# EAGLE design rosscomp_smd (EAGLE 9.0.0)
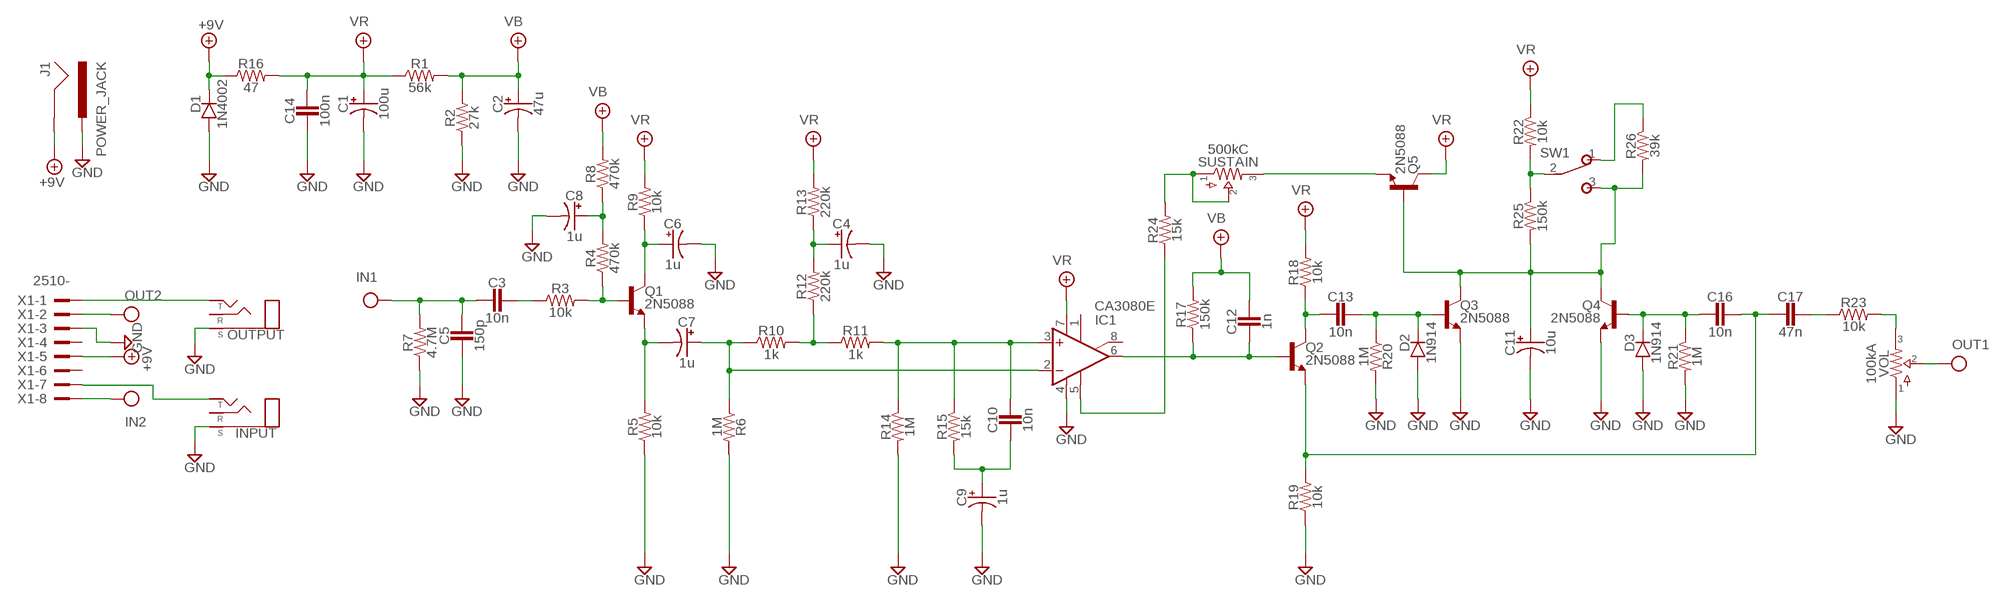
[diagram p0: schematic, sheet 1]

## Parts
C1  100u  CAP-POL0605  [CPOL-0605]
C2  47u  CAP-POL0505  [CPOL-0505]
C3  10n  CAP0805  [0805]
C4  1u  CAP-POL0405  [CPOL-0405]
C5  150p  CAP0805  [0805]
C6  1u  CAP-POL0405  [CPOL-0405]
C7  1u  CAP-POL0405  [CPOL-0405]
C8  1u  CAP-POL0405  [CPOL-0405]
C9  1u  CAP-POL0405  [CPOL-0405]
C10  10n  CAP0805  [0805]
C11  10u  CAP-POL0405  [CPOL-0405]
C12  1n  CAP0805  [0805]
C13  10n  CAP0805  [0805]
C14  100n  CAP0805  [0805]
C16  10n  CAP0805  [0805]
C17  47n  CAP0805  [0805]
D1  1N4002  DIODEDO214AC  [D-DO214AC]
D2  1N914  DIODESOD323  [D-SOD323]
D3  1N914  DIODESOD323  [D-SOD323]
IC1  CA3080E  3080SMD  [SO08]
INPUT  STEREONMJ  [NMJ6HCD2]
J1  POWER_JACK  [POWER_JACK_PTH]
OUTPUT  STEREONMJ  [NMJ6HCD2]
Q1  2N5088  NPNNPN  [SOT23]
Q2  2N5088  NPNNPN  [SOT23]
Q3  2N5088  NPNNPN  [SOT23]
Q4  2N5088  NPNNPN  [SOT23]
Q5  2N5088  NPNNPN  [SOT23]
R1  56k  RESISTOR0805  [0805]
R2  27k  RESISTOR0805  [0805]
R3  10k  RESISTOR0805  [0805]
R4  470k  RESISTOR0805  [0805]
R5  10k  RESISTOR0805  [0805]
R6  1M  RESISTOR0805  [0805]
R7  4.7M  RESISTOR0805  [0805]
R8  470k  RESISTOR0805  [0805]
R9  10k  RESISTOR0805  [0805]
R10  1k  RESISTOR0805  [0805]
R11  1k  RESISTOR0805  [0805]
R12  220k  RESISTOR0805  [0805]
R13  220k  RESISTOR0805  [0805]
R14  1M  RESISTOR0805  [0805]
R15  15k  RESISTOR0805  [0805]
R16  47  RESISTOR1206  [1206]
R17  150k  RESISTOR0805  [0805]
R18  10k  RESISTOR0805  [0805]
R19  10k  RESISTOR0805  [0805]
R20  1M  RESISTOR0805  [0805]
R21  1M  RESISTOR0805  [0805]
R22  10k  RESISTOR0805  [0805]
R23  10k  RESISTOR0805  [0805]
R24  15k  RESISTOR0805  [0805]
R25  150k  RESISTOR0805  [0805]
R26  39k  RESISTOR0805  [0805]
SUSTAIN  500kC  POTS16MM  [16MM]
SW1  SPDT  [M9040P]
VOL  100kA  POTS16MM  [16MM]
X1  2510-  [PAK100/2500-10]

## Nets
+9V: D1.C J1.GND R16.1 X1.5
GND: C1.- C2.- C4.- C5.2 C6.- C8.- C9.- C11.- C14.1 D1.A D2.2(A) D3.2(A) IC1.4(V-) INPUT.S J1.PWR OUTPUT.S Q3.E Q4.E R2.1 R5.1 R6.2 R7.1 R14.2 R19.1 R20.2 R21.2 VOL.1 X1.3
IN: C3.2 C5.1 R7.2 X1.8
N$1: INPUT.T X1.7
N$2: C3.1 R3.1
N$3: Q1.B R3.2 R4.1
N$4: OUTPUT.T X1.1
N$5: C8.+ R4.2 R8.1
N$6: R26.1 SW1.1(O)
N$7: C6.+ Q1.C R9.1
N$8: C7.+ IC1.2(-IN) R6.1 R10.1
N$9: C7.- Q1.E R5.2
N$10: C10.1 IC1.3(+IN) R11.2 R14.1 R15.1
N$11: R10.2 R11.1 R12.1
N$12: C4.+ R12.2 R13.1
N$13: C9.+ C10.2 R15.2
N$14: C13.2 Q2.C R18.1
N$15: C12.2 IC1.6(OUT) Q2.B R17.1
N$16: C16.1 C17.2 Q2.E R19.2
N$17: C13.1 D2.1(C) Q3.B R20.1
N$18: C11.+ Q3.C Q4.C Q5.B R25.2 R26.2 SW1.3(S)
N$19: C16.2 D3.1(C) Q4.B R21.1
N$20: R22.2 R25.1 SW1.2(P)
N$21: C17.1 R23.1
N$22: R23.2 VOL.3
N$23: Q5.E SUSTAIN.3
N$25: R24.2 SUSTAIN.1 SUSTAIN.2
N$26: IC1.5(OPT) R24.1
OUT: VOL.2 X1.2
VB: C2.+ C12.1 R1.2 R2.2 R8.2 R17.2
VR: C1.+ C14.2 IC1.7(V+) Q5.C R1.1 R9.2 R13.2 R16.2 R18.2 R22.1
Unconnected: IC1.1(ON1) IC1.8(ON2) INPUT.R OUTPUT.R X1.4 X1.6

## Library data of the parts
C1 C2 C4 C6-C9 C11 = pedals-SMD:CAP-POL
C3 C5 C10 C12-C14 C16 C17 = pedals-SMD:CAP
D1-D3 = pedals-SMD:DIODE
IC1 = pedals-integrated circuits:3080: OP AMP
INPUT OUTPUT = pedals-jacks:STEREO
J1 = pedals-jacks:POWER_JACK: Power Jack Connector This is the standard 5.5mm barrel jack for power. The PTH is the most common, proven, reliable, footprint. The Slot footprint only works if the mill layer is transmitted to the PCB fab house so be warned. Here are the connectors we sell at SparkFun: DC Barrel Power Jack/Connector <https://www.sparkfun.com/products/119> (PRT-00119) DC Barrel Power Jack/Connector (SMD) <https://www.sparkfun.com/products/12748> (PRT-12748) DC Barrel Jack Adapter - Breadboard Compatible <https://www.sparkfun.com/products/10811> (PRT-10811) It is used on this SparkFun product (and many, many others): SparkFun RedBoard - Programmed with Arduino <https://www.sparkfun.com/products/12757> (DEV-12757) Also, if you need a mating power supply or connector, please check these out: Wall Adapter Power Supply - 9VDC 650mA <https://www.sparkfun.com/products/298> (TOL-00298) DC Barrel Jack Adapter - Male <https://www.sparkfun.com/products/10287> (PRT-10287); PROD_ID: CONN-08197
Q1-Q5 = pedals-SMD:NPN
R1-R26 = pedals-SMD:RESISTOR
SUSTAIN VOL = pedals-potentiometers:POTS
SW1 = pedals-switches:SPDT: TOGGLE SWITCH Marquardt
X1 = pedals-headers:2510-: 3M (TM) Pak 100 4-Wall Header Source: 3M; MF: 3M; MPN: 2510-6002UB; OC_FARNELL: 9838244; OC_NEWARK: 46F4725

## Board
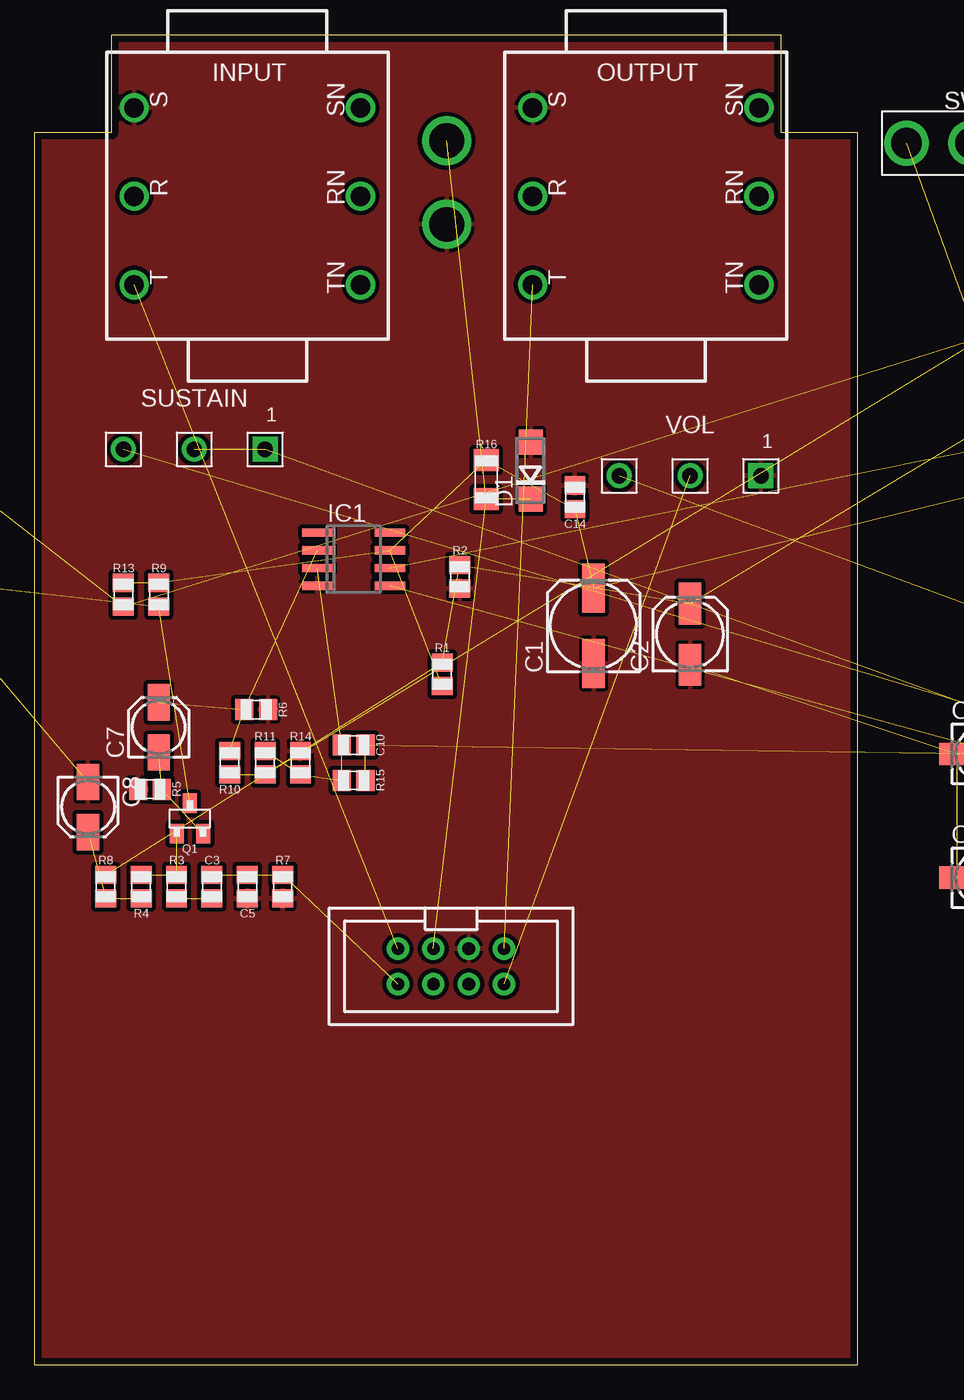
[diagram p1: board, top side]
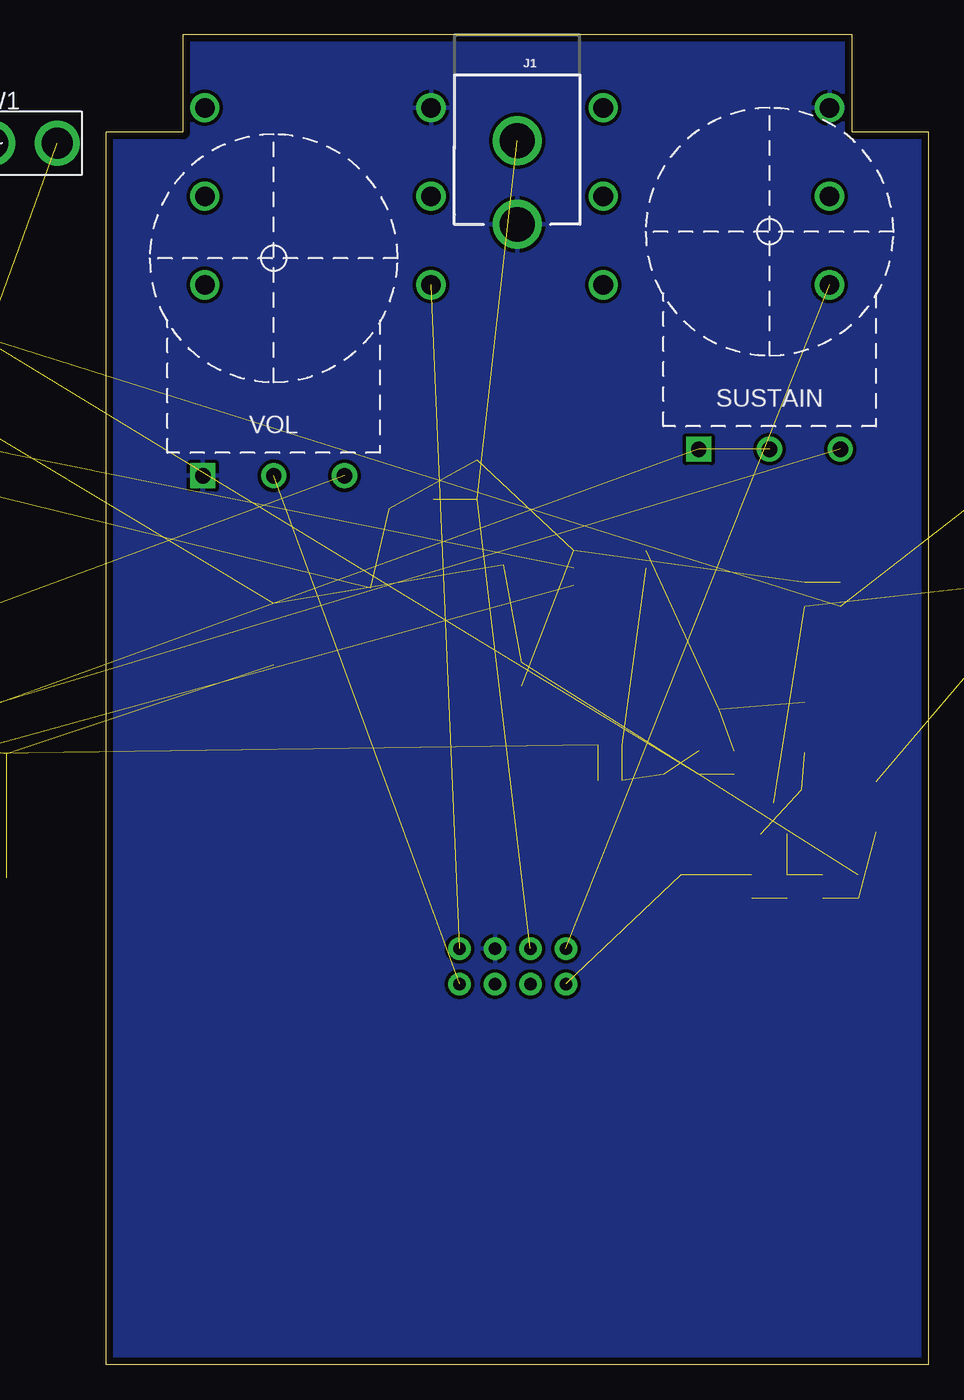
[diagram p2: board, bottom side, seen from below]

Size 59 x 95.4 mm. Coordinates in mm from the lower left corner, seen from the top.
Copper layers (1*16): Top 0.035mm / dielectric 1.6mm / Bottom 0.035mm
Design rules "Elecrow_2-layer_PCB_eagle_rule": minimum track width 6mil, minimum drill 12mil, track to track 6mil, track to pad 6mil, pad to pad 6mil, via to via 8mil, smd to smd 0mil, copper to edge 20mil, drill to drill 10mil, minimum pad ring 6mil, minimum via ring 6mil, stop-mask expansion 0mil, vias tented up to drill 100mil, thermal gap 10mil

### Footprints (pad centres in the part's own frame; a part is rotated, then mirrored left to right if it is on the bottom)
CPOL-0605 = smd 3.5 x 1.6: + 3,-0.7; - -2.4,-0.7
CPOL-0505 = smd 3 x 1.6: + 2.2,0; - -2.2,0
0805 = smd 1.3 x 1.5: 1 -0.85,0; 2 0.85,0
CPOL-0405 = smd 2.6 x 1.6: + 1.8,0; - -1.8,0
D-DO214AC = smd 1.8 x 1.7: A 2.05,0; C -2.05,0
D-SOD323 = smd 1 x 0.6: 1 -1.1,0; 2 1.1,0
SO08 = smd 0.6 x 2.2: 1 -1.905,-2.6; 2 -0.635,-2.6; 3 0.635,-2.6; 4 1.905,-2.6; 5 1.905,2.6; 6 0.635,2.6; 7 -0.635,2.6; 8 -1.905,2.6
NMJ6HCD2 = drill 1.4: R 0,8.115; RN 0,-8.115; S 6.35,8.115; SN 6.35,-8.115; T -6.35,8.115; TN -6.35,-8.115
POWER_JACK_PTH = drill 2.5: GND 0,7.7; PWR 0,13.7
SOT23 = smd 1 x 1.4: B -0.95,-1.1; C 0,1.1; E 0.95,-1.1
1206 = smd 1.6 x 1.8: 1 -1.4,0; 2 1.4,0
16MM = drill 1.1 pad 1.8 square: 1 5.08,-1 | drill 1.1 pad 1.8: 2 0,-1; 3 -5.08,-1
M9040P = drill 2.2 pad 2.9 square: 1 4.636,0 | drill 2.2 pad 2.9: 2 0,0; 3 -4.61,0
PAK100/2500-10 = drill 0.9 pad 1.6: 1 -3.81,-1.27; 2 -3.81,1.27; 3 -1.27,-1.27; 4 -1.27,1.27; 5 1.27,-1.27; 6 1.27,1.27; 7 3.81,-1.27; 8 3.81,1.27

### Placement (x,y rotation side)
C1  39.37,52.7 90 top
C2  46.99,52.41 90 top
C3  12.7,34.29 90 top
C4  -6.35,62.87 0 top  (outside the outline)
C5  15.24,34.29 270 top
C6  -6.35,55.88 0 top  (outside the outline)
C7  8.89,45.72 90 top
C8  3.81,40.01 270 top
C9  67.94,43.81 0 top  (outside the outline)
C10  22.86,44.45 0 top
C11  67.94,34.93 0 top  (outside the outline)
C12  77.47,72.39 0 top  (outside the outline)
C13  77.47,60.33 0 top  (outside the outline)
C14  38.73,62.23 270 top
C16  77.47,33.66 0 top  (outside the outline)
C17  92.08,49.53 0 top  (outside the outline)
D1  35.56,64.14 90 top
D2  77.47,55.25 0 top  (outside the outline)
D3  77.47,38.73 0 top  (outside the outline)
IC1  22.86,57.79 270 top
INPUT  15.24,83.82 90 top
J1  29.53,95.5 180 bottom
OUTPUT  43.81,83.82 90 top
Q1  11.11,39.18 0 top
Q2  77.47,68.58 0 top  (outside the outline)
Q3  77.47,51.44 0 top  (outside the outline)
Q4  77.47,46.99 0 top  (outside the outline)
Q5  92.08,40.64 0 top  (outside the outline)
R1  29.21,49.53 90 top
R2  30.48,56.52 90 top
R3  10.16,34.29 90 top
R4  7.62,34.29 270 top
R5  8.26,41.28 0 top
R6  15.88,46.99 0 top
R7  17.78,34.29 90 top
R8  5.08,34.29 90 top
R9  8.89,55.25 90 top
R10  13.97,43.18 270 top
R11  16.51,43.18 90 top
R12  70.91,74.93 0 top  (outside the outline)
R13  6.35,55.25 90 top
R14  19.05,43.18 90 top
R15  22.86,41.91 0 top
R16  32.38,63.5 90 top
R17  78.74,74.93 0 top  (outside the outline)
R18  78.74,65.41 0 top  (outside the outline)
R19  78.74,62.87 0 top  (outside the outline)
R20  78.74,57.79 0 top  (outside the outline)
R21  78.74,36.2 0 top  (outside the outline)
R22  93.34,46.99 0 top  (outside the outline)
R23  93.34,44.45 0 top  (outside the outline)
R24  93.34,37.47 0 top  (outside the outline)
R25  70.91,49.53 0 top  (outside the outline)
R26  70.91,62.23 0 top  (outside the outline)
SUSTAIN  11.43,66.68 0 top
SW1  67.12,87.63 0 top  (outside the outline)
U$2  [125B_PCB_HUGER]  0,7.62 0 top
VOL  46.99,64.77 0 top
X1  29.84,28.58 180 top

### Tracks (layer width: path | path; a pad name or v marks a point on that pad's centre or on a via)
+9V  (3 unrouted)
GND  (11 unrouted)
  pour Bottom (isolate 0.254): 0,96.52 0,-0.63 59.05,-0.63 59.05,96.52
  pour Top (isolate 0.305): -0.64,-0.63 59.69,-0.63 59.69,96.52 -0.64,96.52
IN  (3 unrouted)
N$1  (1 unrouted)
N$2  (1 unrouted)
N$3  (2 unrouted)
N$4  (1 unrouted)
N$5  (2 unrouted)
N$6  (1 unrouted)
N$7  (2 unrouted)
N$8  (3 unrouted)
N$9  (2 unrouted)
N$10  (4 unrouted)
N$11  (2 unrouted)
N$12  (2 unrouted)
N$13  (2 unrouted)
N$14  (2 unrouted)
N$15  (3 unrouted)
N$16  (3 unrouted)
N$17  (3 unrouted)
N$18  (6 unrouted)
N$19  (3 unrouted)
N$20  (2 unrouted)
N$21  (1 unrouted)
N$22  (1 unrouted)
N$23  (1 unrouted)
N$25  (2 unrouted)
N$26  (1 unrouted)
OUT  (1 unrouted)
VB  (5 unrouted)
VR  (9 unrouted)